# EAGLE design ambisoniqueAmpli (EAGLE 7.6.0)
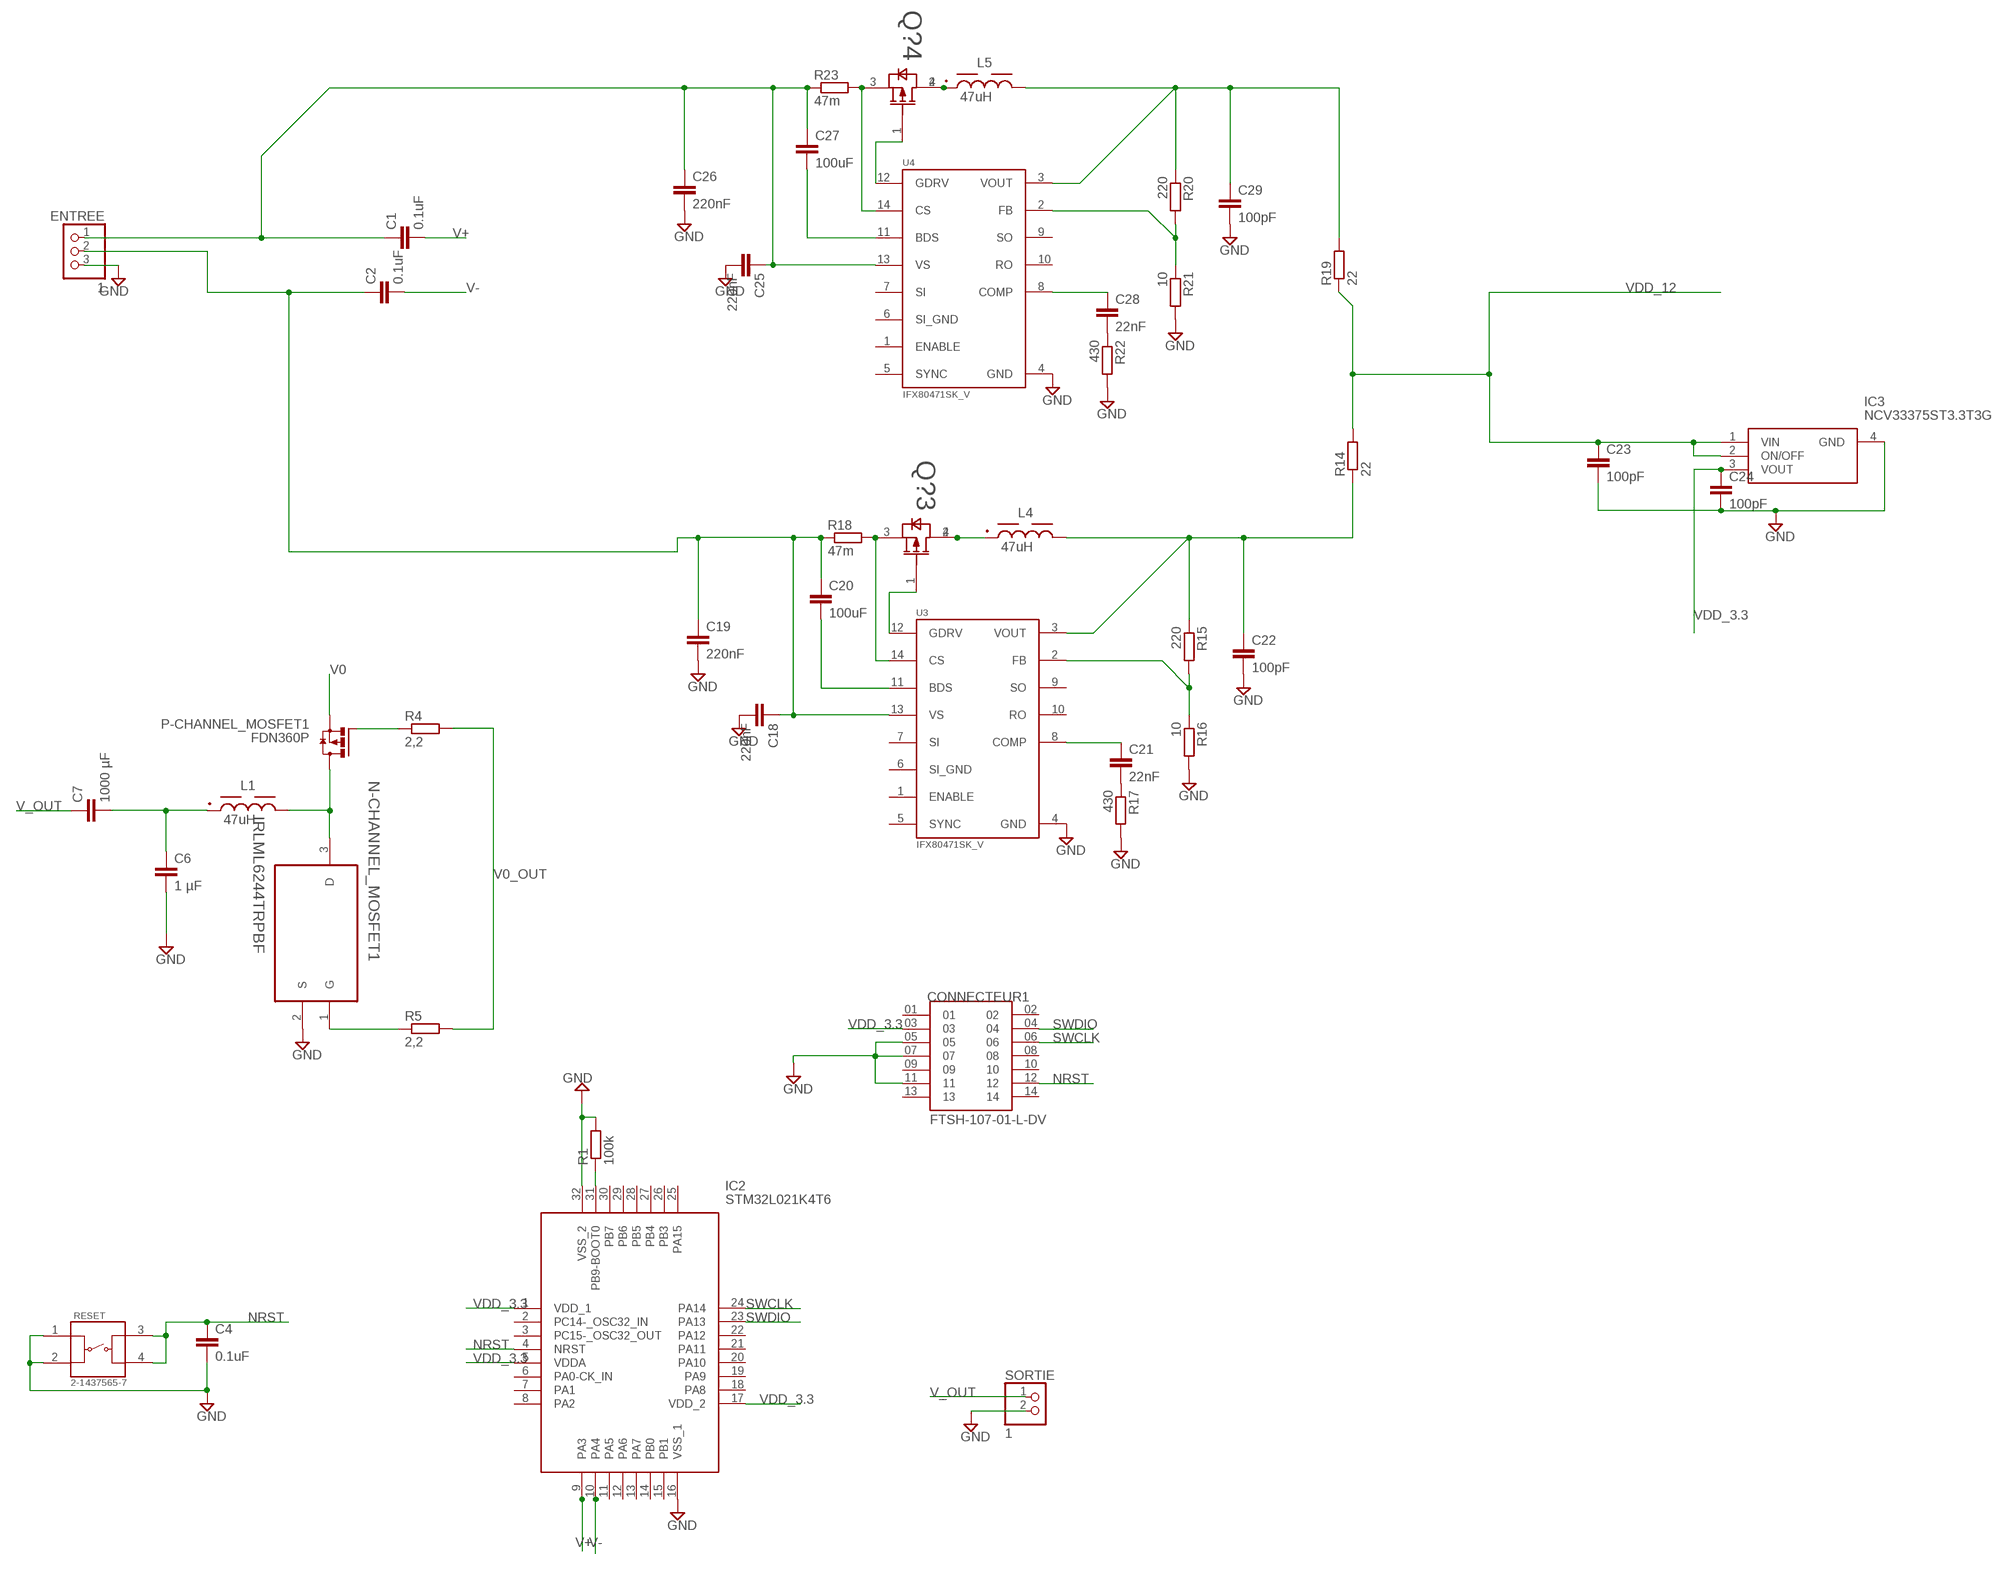
[diagram p0: schematic, sheet 1]

## Parts
C1  0.1uF  C-EUC0603  [C0603]
C2  0.1uF  C-EUC0603  [C0603]
C4  0.1uF  C-EUC0603  [C0603]
C6  1 µF  C-EUC0603  [C0603]
C7  1000 µF  C-EUC0603  [C0603]
C18  220nF  C-EUC0603  [C0603]
C19  220nF  C-EUC0603  [C0603]
C20  100uF  C-EUC0603  [C0603]
C21  22nF  C-EUC0603  [C0603]
C22  100pF  C-EUC0603  [C0603]
C23  100pF  C-EUC0603  [C0603]
C24  100pF  C-EUC0603  [C0603]
C25  220nF  C-EUC0603  [C0603]
C26  220nF  C-EUC0603  [C0603]
C27  100uF  C-EUC0603  [C0603]
C28  22nF  C-EUC0603  [C0603]
C29  100pF  C-EUC0603  [C0603]
CONNECTEUR1  FTSH-107-01-L-DV  [SAMTEC_FTSH-107-01-L-DV]
ENTREE  1  PINHD-1X3  [1X03]
IC2  STM32L021K4T6  [QFP80P900X900X160-32N]
IC3  NCV33375ST3.3T3G  [SOT230P700X175-4N]
L1  47uH  WE-PDA_1210_7847709470  [WE-PDA_1210]
L4  47uH  WE-PDA_1210_7847709470  [WE-PDA_1210]
L5  47uH  WE-PDA_1210_7847709470  [WE-PDA_1210]
N-CHANNEL_MOSFET1  IRLML6244TRPBF  [SOT95P237X112-3N]
P-CHANNEL_MOSFET1  FDN360P  [SUPER-SOT3]
Q?3  BSP613P  [SOT230P700X170-4N]
Q?4  BSP613P  [SOT230P700X170-4N]
R1  100k  R-EU_R0603  [R0603]
R4  2,2  R-EU_R0603  [R0603]
R5  2,2  R-EU_R0603  [R0603]
R14  22  R-EU_R0603  [R0603]
R15  220  R-EU_R0603  [R0603]
R16  10  R-EU_R0603  [R0603]
R17  430  R-EU_R0603  [R0603]
R18  47m  R-EU_R0603  [R0603]
R19  22  R-EU_R0603  [R0603]
R20  220  R-EU_R0603  [R0603]
R21  10  R-EU_R0603  [R0603]
R22  430  R-EU_R0603  [R0603]
R23  47m  R-EU_R0603  [R0603]
RESET  2-1437565-7  [SW_2-1437565-7]
SORTIE  1  PINHD-1X2  [1X02]
U3  IFX80471SK_V  [SOIC127P600X175-14N-8]
U4  IFX80471SK_V  [SOIC127P600X175-14N-8]

## Nets
GND: C4.2 C6.2 C18.2 C19.2 C22.2 C23.2 C24.2 C25.2 C26.2 C29.2 CONNECTEUR1.05 CONNECTEUR1.07 CONNECTEUR1.11 ENTREE.3 IC2.16(VSS_1) IC2.32(VSS_2) IC3.4(GND) N-CHANNEL_MOSFET1.2(S) R1.2 R16.2 R17.2 R21.2 R22.2 RESET.1 RESET.2 SORTIE.2 U3.4(GND) U4.4(GND)
N$1: C28.2 R22.1
N$2: IC2.31(PB9-BOOT0) R1.1
N$3: C21.2 R17.1
N$5: P-CHANNEL_MOSFET1.1(G) R4.1
N$6: L1.2 N-CHANNEL_MOSFET1.3(D) P-CHANNEL_MOSFET1.3(D)
N$7: C6.1 C7.2 L1.1
N$9: N-CHANNEL_MOSFET1.1(G) R5.1
N$27: Q?3.3(SOURCE) R18.2 U3.14(CS)
N$28: Q?3.1(GATE) U3.12(GDRV)
N$29: C20.2 U3.11(BDS)
N$31: L4.1 Q?3.2(DRAIN_1) Q?3.4(DRAIN_2)
N$32: C21.1 U3.8(COMP)
N$33: R15.2 R16.1 U3.2(FB)
N$34: C22.1 L4.2 R14.1 R15.1 U3.3(VOUT)
N$35: Q?4.3(SOURCE) R23.2 U4.14(CS)
N$36: Q?4.1(GATE) U4.12(GDRV)
N$37: C27.2 U4.11(BDS)
N$39: L5.1 Q?4.2(DRAIN_1) Q?4.4(DRAIN_2)
N$40: C28.1 U4.8(COMP)
N$41: R20.2 R21.1 U4.2(FB)
N$42: C29.1 L5.2 R19.2 R20.1 U4.3(VOUT)
NRST: C4.1 CONNECTEUR1.12 IC2.4(NRST) RESET.3 RESET.4
SWCLK: CONNECTEUR1.06 IC2.24(PA14)
SWDIO: CONNECTEUR1.04 IC2.23(PA13)
V0: P-CHANNEL_MOSFET1.2(S)
V0_OUT: R4.2 R5.2
V+: C1.2 IC2.9(PA3)
V+_IN: C1.1 C25.1 C26.1 C27.1 ENTREE.1 R23.1 U4.13(VS)
V-: C2.2 IC2.10(PA4)
V-_IN: C2.1 C18.1 C19.1 C20.1 ENTREE.2 R18.1 U3.13(VS)
V_OUT: C7.1 SORTIE.1
VDD_3.3: C24.1 CONNECTEUR1.03 IC2.1(VDD_1) IC2.5(VDDA) IC2.17(VDD_2) IC3.3(VOUT)
VDD_12: C23.1 IC3.1(VIN) IC3.2(ON/OFF) R14.2 R19.1
Unconnected: CONNECTEUR1.01 CONNECTEUR1.02 CONNECTEUR1.08 CONNECTEUR1.09 CONNECTEUR1.10 CONNECTEUR1.13 CONNECTEUR1.14 IC2.2(PC14-_OSC32_IN) IC2.3(PC15-_OSC32_OUT) IC2.6(PA0-CK_IN) IC2.7(PA1) IC2.8(PA2) IC2.11(PA5) IC2.12(PA6) IC2.13(PA7) IC2.14(PB0) IC2.15(PB1) IC2.18(PA8) IC2.19(PA9) IC2.20(PA10) IC2.21(PA11) IC2.22(PA12) IC2.25(PA15) IC2.26(PB3) IC2.27(PB4) IC2.28(PB5) IC2.29(PB6) IC2.30(PB7) U3.1(ENABLE) U3.5(SYNC) U3.7(SI) U3.9(SO) U3.10(RO) U4.1(ENABLE) U4.5(SYNC) U4.7(SI) U4.9(SO) U4.10(RO)

## Power pins joined to a net without a drawn wire
SI_GND: U3.6(SI_GND) U4.6(SI_GND)

## Library data of the parts
C1 C2 C4 C6 C7 C18-C29 = rcl:C-EU: CAPACITOR, European symbol
CONNECTEUR1 = FTSH-107-01-L-DV:FTSH-107-01-L-DV; MANUFACTURER: Samtec; PARTREV: R; STANDARD: Manufacturer Recommendations
ENTREE = pinhead:PINHD-1X3: PIN HEADER
IC2 = SamacSys_Parts:STM32L021K4T6: ARM Microcontrollers - MCU 16/32-BITS MICROS Source: Datasheet <https://www.st.com/resource/en/datasheet/stm32l021k4.pdf>; DESCRIPTION: ARM Microcontrollers - MCU 16/32-BITS MICROS; HEIGHT: 1.6mm; MANUFACTURER_NAME: STMicroelectronics; MANUFACTURER_PART_NUMBER: STM32L021K4T6; MOUSER_PART_NUMBER: 511-STM32L021K4T6; MOUSER_PRICE-STOCK: https://www.mouser.co.uk/ProductDetail/STMicroelectronics/STM32L021K4T6?qs=dTJS0cRn7ohCWAWNqbLYkA%3D%3D
IC3 = SamacSys_Parts:NCV33375ST3.3T3G: ON SEMICONDUCTOR - NCV33375ST3.3T3G - Fixed LDO Voltage Regulator, 4.3V to 13V, 260mV Dropout, 3.3Vout, 300mAout, SOT-223-4 Source: Datasheet <http://www.onsemi.com/pub/Collateral/MC33375-D.PDF>; DESCRIPTION: ON SEMICONDUCTOR - NCV33375ST3.3T3G - Fixed LDO Voltage Regulator, 4.3V to 13V, 260mV Dropout, 3.3Vout, 300mAout, SOT-223-4; HEIGHT: 1.75mm; MANUFACTURER_NAME: onsemi; MANUFACTURER_PART_NUMBER: NCV33375ST3.3T3G; MOUSER_PART_NUMBER: 863-NCV33375ST3.3T3G; MOUSER_PRICE-STOCK: https://www.mouser.co.uk/ProductDetail/ON-Semiconductor/NCV33375ST33T3G?qs=Pqj8oIac8rWOl%252BM3OwXrOg%3D%3D
L1 L4 L5 = Eagle_WE-PDA (rev20b):WE-PDA_1210: WE-PDA SMD Shielded Power Inductor Characteristics Magnetically shielded version which results in a low leakage field High storage capacity High Saturation currents up to 23 A Very low self-losses at high switching frequency's Wide inductance spectrum available at all sizes Operating Temperature -40 °C up to +125 °C Core Material: NiZn Wire connection: welding technology Applications Multimedia applications Switching regulators with low operating voltages Integrated DC/DC-converter Perfect suitable for switching regulators with extremely high efficiency (> 86 %) Plastic base: Because of the one piece construction these are more suitable for high vibration or shock applications <https://www.we-online.com/catalog/media/o55118v209%20Family_WE-PDA.jpg> Details see: https://www.we-online.com/katalog/en/WE-PDA Updated by Ella Wu 2020-03-18 2020(C) Wurth Elektronik; DATASHEET-URL: https://www.we-online.com/catalog/datasheet/7847709470.pdf; FRES: 6.3MHz; IR: 3.2A; ISAT: 3.5A; MOUNT: SMT; PART-NUMBER: 7847709470; RDC-MAX: 67mOhm; RDC-TYP: 56mOhm
N-CHANNEL_MOSFET1 = IR-IRLML6244TRPBF@E:IRLML6244TRPBF: HEXFET Power MOSFET; MPN: IRLML6244TRPBF; OC_FARNELL: 1864517; OC_NEWARK: 84R9705; PACKAGE: SOT-3; SUPPLIER: International Rectifier
P-CHANNEL_MOSFET1 = transistor-power:FDN360P: Single P-Channel, PowerTrench (R) MOSFET Source: http://www.fairchildsemi.com/ds/FD/FDN360P.pdf
Q?3 Q?4 = BSP613P:BSP613P: BSP613P SOT230P700X170-4N Insulated-Gate Field-Effect Transistor (IGFET), P-Channel, Enhancement, Body Diode, Pin 1 Gate, 2 Drain, 3 Source, 4 Drain, 4 Pins
R1 R4 R5 R14-R23 = rcl:R-EU_: RESISTOR, European symbol
RESET = 2-1437565-7:2-1437565-7: FSM2JSMA=SMT,TACTILE,PB SWITCH Check availability <https://pricing.snapeda.com/parts/FSM2JSMA/TE%20Connectivity/view-part?ref=eda>; AVAILABILITY: In Stock; COMMENT: 2-1437565-7; CONFIGURATION_POLE-THROW: Single Pole - Single Throw; CONTACT_CURRENT_RATING: 50 mA; DESCRIPTION: Tactile Switch SPST-NO Top Actuated Surface Mount; MF: TE Connectivity; MP: FSM2JSMA; PACKAGE: None; PRICE: None; PURCHASE-URL: https://pricing.snapeda.com/search/part/FSM2JSMA/?ref=eda
SORTIE = pinhead:PINHD-1X2: PIN HEADER
U3 U4 = IFX80471SK V:IFX80471SK_V: IFX80471SK V Step-Down DC/DC Controller, Adjustable Version SOIC127P600X175-14N-8

## Board
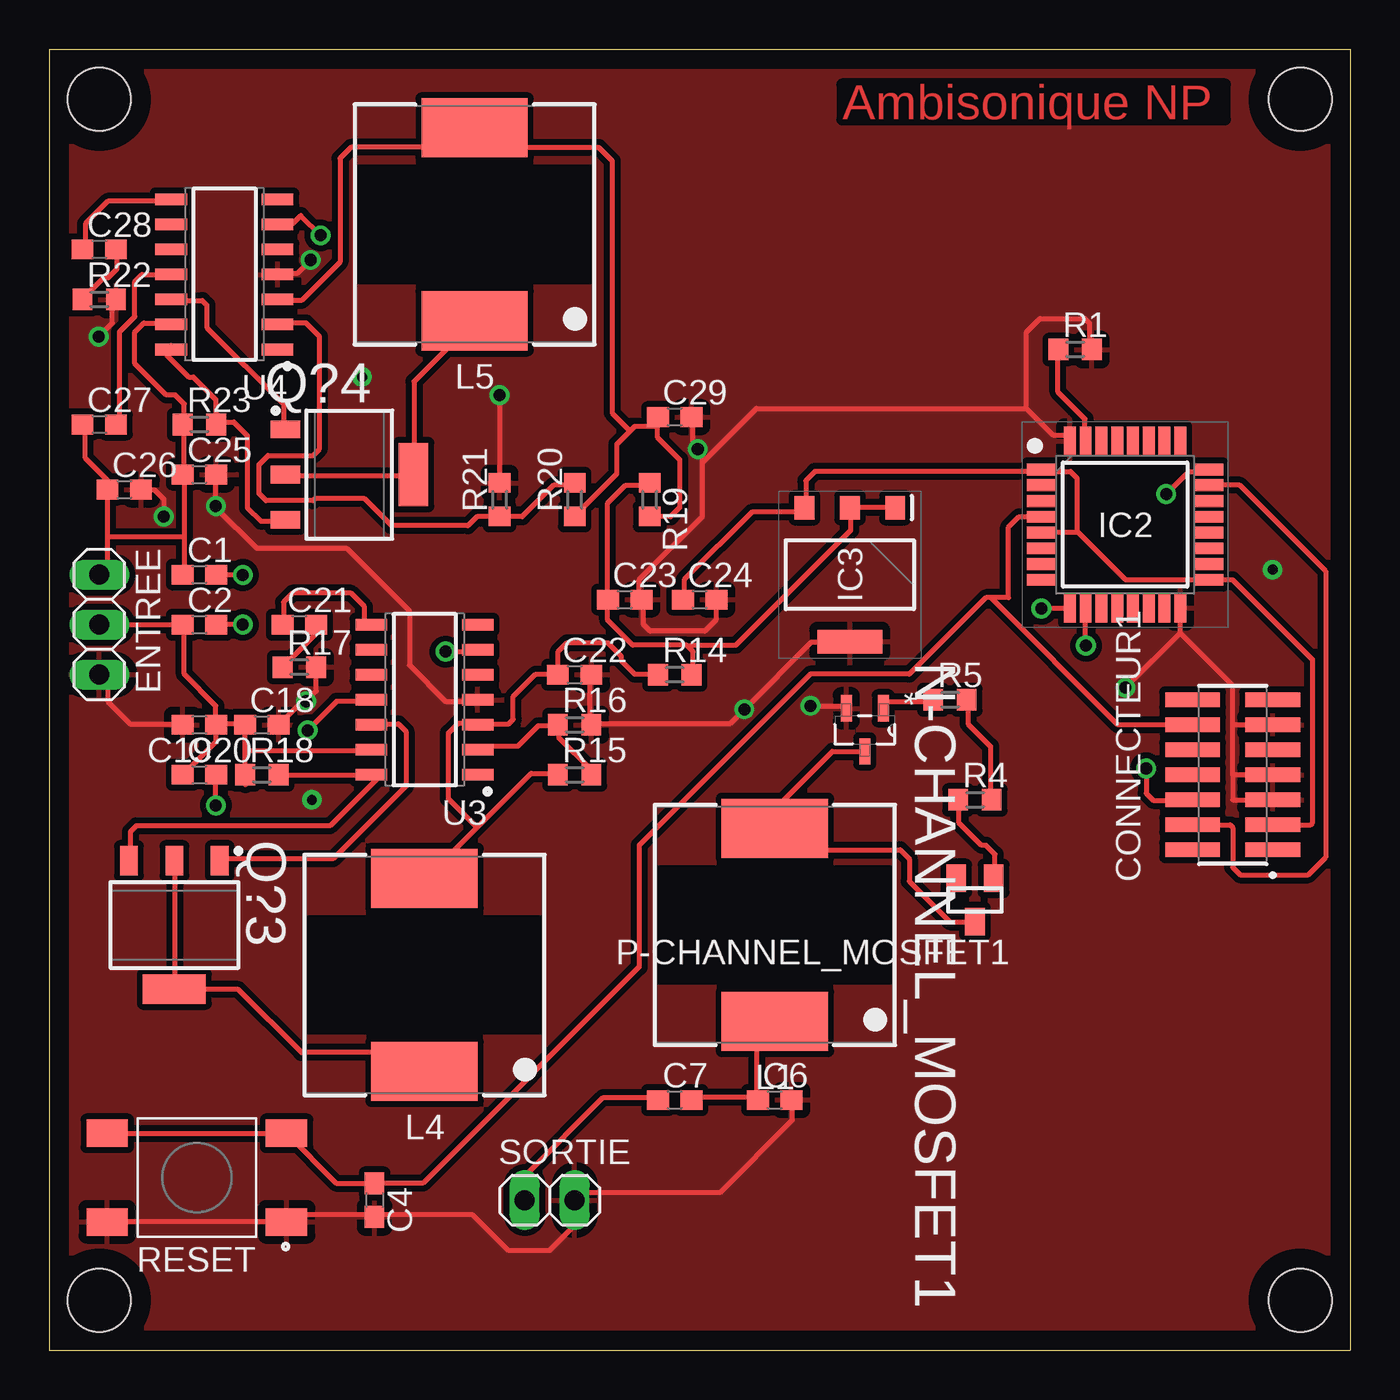
[diagram p1: board, top side]
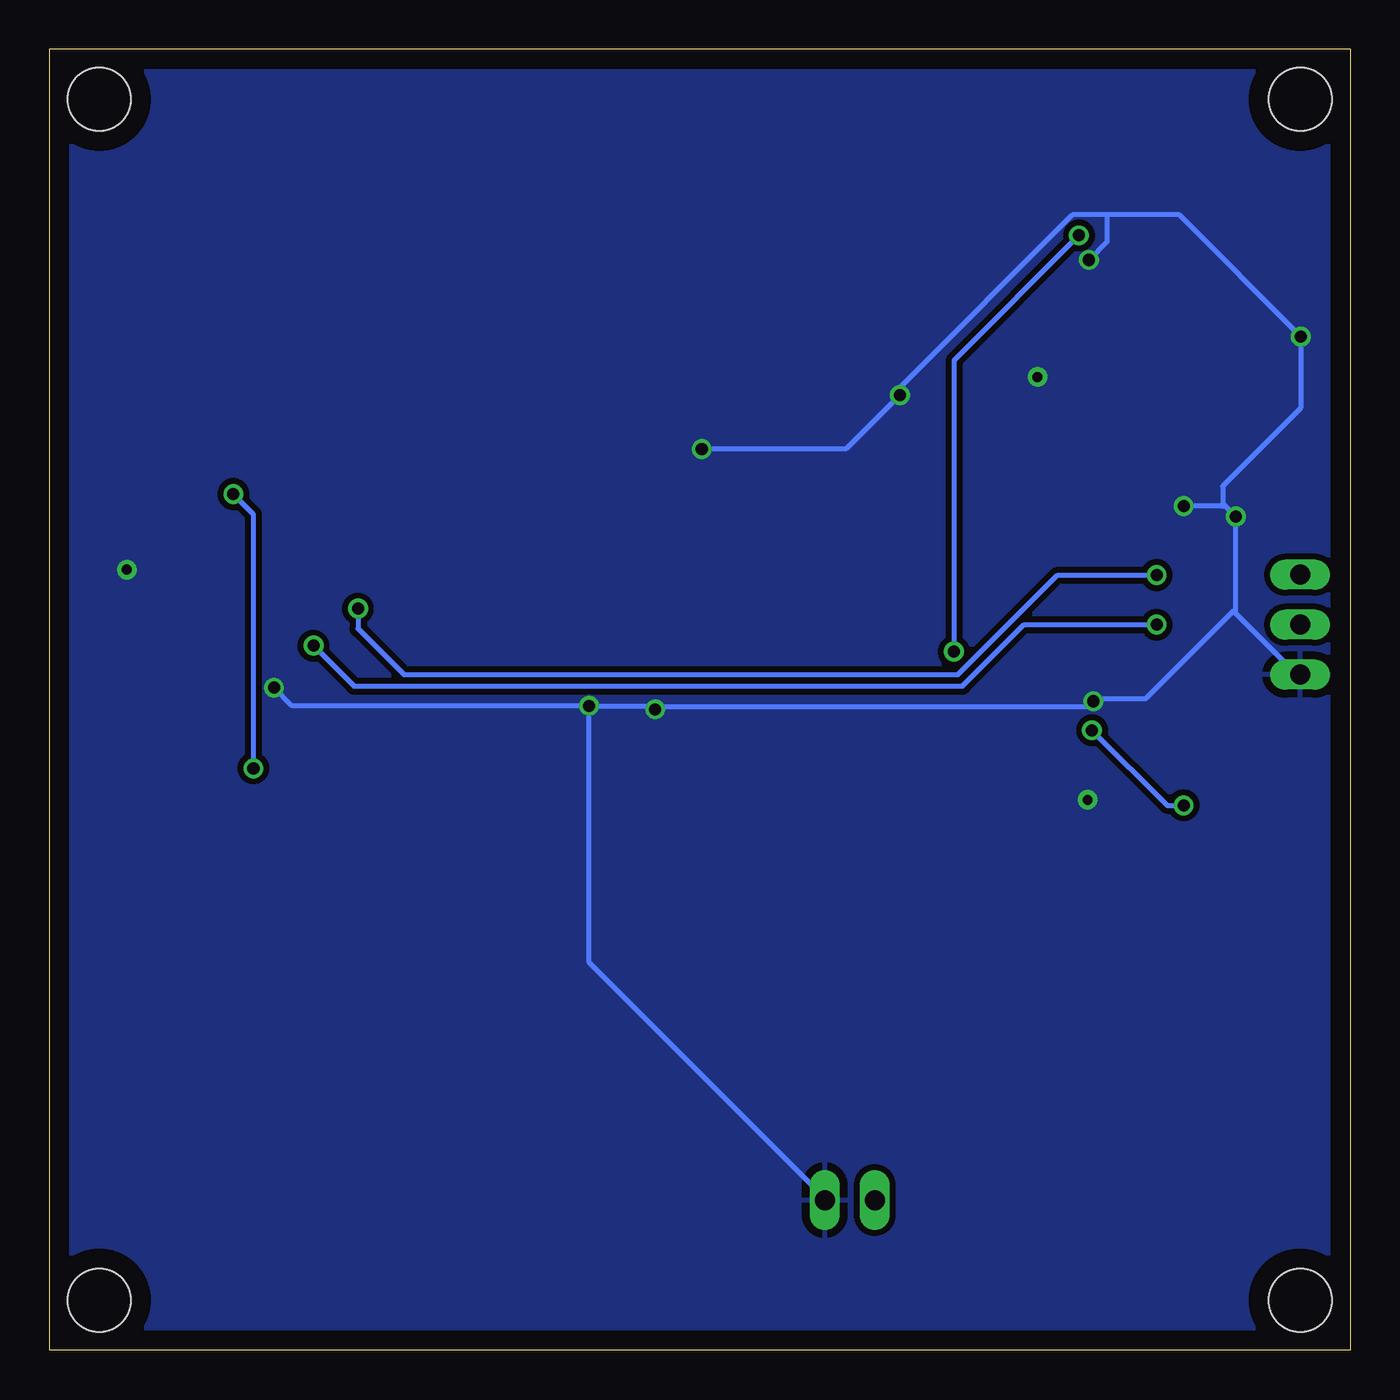
[diagram p2: board, bottom side, seen from below]

Size 66.04 x 66.04 mm. Coordinates in mm from the lower left corner, seen from the top.
Outline: 0,0 0,66.04 66.04,66.04 66.04,0 0.01,0
Copper layers (1*16): Top 0.035mm / dielectric 1.5mm / Bottom 0.035mm
Design rules "ENSEA_2022_04_08 *": minimum track width 0.2mm, minimum drill 0.6mm, track to track 0.3mm, track to pad 0.3mm, pad to pad 0.3mm, via to via 0.3mm, smd to smd 0.3mm, copper to edge 1mm, drill to drill 0.4mm, minimum pad ring 0.2mm, minimum via ring 0.2mm, stop-mask expansion 4mil, vias tented up to drill 0mil, thermal gap 0.4mm
Holes 3.2 mm at 2.54,2.54 2.54,63.5 63.5,63.5 63.5,2.54

### Footprints (pad centres in the part's own frame; a part is rotated, then mirrored left to right if it is on the bottom)
C0603 = smd 1.1 x 1: 1 -0.85,0; 2 0.85,0
SAMTEC_FTSH-107-01-L-DV = smd 0.74 x 2.79: 01 -3.81,-2.035; 02 -3.81,2.035; 03 -2.54,-2.035; 04 -2.54,2.035; 05 -1.27,-2.035; 06 -1.27,2.035; 07 0,-2.035; 08 0,2.035; 09 1.27,-2.035; 10 1.27,2.035; 11 2.54,-2.035; 12 2.54,2.035; 13 3.81,-2.035; 14 3.81,2.035
1X03 = drill 1.016 long: 1 -2.54,0; 2 0,0; 3 2.54,0
QFP80P900X900X160-32N = smd 1.475 x 0.6: 1 -4.238,2.8; 2 -4.238,2; 3 -4.238,1.2; 4 -4.238,0.4; 5 -4.238,-0.4; 6 -4.238,-1.2; 7 -4.238,-2; 8 -4.238,-2.8; 17 4.238,-2.8; 18 4.238,-2; 19 4.238,-1.2; 20 4.238,-0.4; 21 4.238,0.4; 22 4.238,1.2; 23 4.238,2; 24 4.238,2.8 | smd 0.6 x 1.475: 9 -2.8,-4.238; 10 -2,-4.238; 11 -1.2,-4.238; 12 -0.4,-4.238; 13 0.4,-4.238; 14 1.2,-4.238; 15 2,-4.238; 16 2.8,-4.238; 25 2.8,4.238; 26 2,4.238; 27 1.2,4.238; 28 0.4,4.238; 29 -0.4,4.238; 30 -1.2,4.238; 31 -2,4.238; 32 -2.8,4.238
SOT230P700X175-4N = smd 1.2 x 1: 1 -3.4,2.3; 2 -3.4,0; 3 -3.4,-2.3 | smd 1.2 x 3.3: 4 3.4,0
WE-PDA_1210 = smd 5.4 x 3: 1 0,4.9; 2 0,-4.9
SOT95P237X112-3N = smd 1.321 x 0.559: 1 -1.092,0.94; 2 -1.092,-0.94; 3 1.092,0
SUPER-SOT3 = smd 1 x 1.4: 1 -0.95,-1.1; 2 0.95,-1.1; 3 0,1.1
SOT230P700X170-4N = smd 1.5 x 0.9: 1 -3.25,2.3; 2 -3.25,0; 3 -3.25,-2.3 | smd 1.5 x 3.2: 4 3.25,0
R0603 = smd 1 x 1.1: 1 -0.85,0; 2 0.85,0
SW_2-1437565-7 = smd 2.1 x 1.4: 1 -4.55,2.25; 2 4.55,2.25; 3 -4.55,-2.25; 4 4.55,-2.25
1X02 = drill 1.016 long: 1 -1.27,0; 2 1.27,0
SOIC127P600X175-14N-8 = smd 1.6 x 0.6: 1 -2.7,3.81; 2 -2.7,2.54; 3 -2.7,1.27; 4 -2.7,0; 5 -2.7,-1.27; 6 -2.7,-2.54; 7 -2.7,-3.81; 8 2.7,-3.81; 9 2.7,-2.54; 10 2.7,-1.27; 11 2.7,0; 12 2.7,1.27; 13 2.7,2.54; 14 2.7,3.81

### Placement (x,y rotation side)
C1  7.62,39.37 0 top
C2  7.62,36.83 0 top
C4  16.51,7.62 270 top
C6  36.83,12.7 0 top
C7  31.75,12.7 0 top
C18  10.79,31.75 0 top
C19  7.62,31.75 180 top
C20  7.62,29.21 0 top
C21  12.7,36.83 0 top
C22  26.67,34.29 0 top
C23  29.21,38.1 0 top
C24  33.02,38.1 0 top
C25  7.62,44.45 0 top
C26  3.81,43.69 0 top
C27  2.54,46.99 0 top
C28  2.54,55.88 0 top
C29  31.75,47.37 0 top
CONNECTEUR1  60.07,29.21 90 top
ENTREE  2.54,36.83 270 top
IC2  54.61,41.91 0 top
IC3  40.64,39.37 270 top
L1  36.83,21.59 180 top
L4  19.05,19.05 180 top
L5  21.59,57.15 180 top
N-CHANNEL_MOSFET1  41.4,31.5 270 top
P-CHANNEL_MOSFET1  46.99,22.86 180 top
Q?3  6.35,21.59 270 top
Q?4  15.24,44.45 0 top
R1  52.07,50.8 0 top
R4  46.99,27.94 0 top
R5  45.72,33.02 0 top
R14  31.75,34.29 0 top
R15  26.67,29.21 0 top
R16  26.67,31.75 0 top
R17  12.7,34.67 0 top
R18  10.79,29.21 0 top
R19  30.48,43.18 270 top
R20  26.67,43.18 90 top
R21  22.86,43.18 90 top
R22  2.54,53.34 0 top
R23  7.62,46.99 0 top
RESET  7.49,8.76 180 top
SORTIE  25.4,7.62 0 top
U3  19.05,33.02 180 top
U4  8.89,54.61 180 top

### Tracks (layer width: path | path; a pad name or v marks a point on that pad's centre or on a via)
GND  (via drill 0.5 pad 1, 0.61)
  Top 0.254: 49.61,47.8 49.61,51.69 50.29,52.38 52.58,52.38 52.81,52.15 52.81,51 R1.2 | 49.61,47.8 50.98,46.43 51.66,46.43 51.89,46.2 IC2.32 | C24.2 33.83,37.97 33.83,37.06 33.27,36.5 30.5,36.5 30.18,36.83 30.18,37.97 C23.2 29.95,38.2 29.95,39.12 33.15,42.32 33.15,45.06 | 33.15,45.06 33.15,45.52 v32.92,45.74 32.69,45.97 32.69,47.27 C29.2 | 49.61,47.8 35.89,47.8 33.15,45.06 | 13.49,34.47 R17.2 13.55,33.46 v13.03,32.94 12.84,32.94 C18.2 | ENTREE.3 2.97,33.86 2.97,32.94 4.12,31.8 6.63,31.8 C19.2 | C25.2 8.46,44.37 v8.46,42.85 8.46,42.77 10.52,40.72 15.09,40.72 18.29,37.52 18.29,34.77 20.12,32.94 21.72,32.94 U3.4 | v2.52,51.46 3.2,52.15 3.2,53.29 R22.2 | v22.86,48.49 R21.2 | v13.26,55.35 12.57,54.66 11.66,54.66 U4.4 | C22.2 27.43,34.09 27.43,31.8 R16.2 27.66,31.8 34.54,31.8 v35.28,32.54 38.66,35.92 40.46,35.92 IC3.4 | 62.2,28.14 CONNECTEUR1.05 60.07,27.94 60.07,29.21 | 62.2,29.06 CONNECTEUR1.07 60.07,29.21 | 61.95,31.8 61.98,31.8 CONNECTEUR1.11 60.07,31.75 | 12.22,6.66 RESET.1 | 3.07,6.66 RESET.2 RESET.1 | 11.99,6.66 RESET.1 | C6.2 37.72,12.6 37.72,11.68 34.06,8.03 26.98,8.03 26.75,7.8 SORTIE.2 26.52,7.57 26.52,6.2 25.38,5.05 23.32,5.05 21.49,6.88 16.69,6.88 C4.2 16.46,6.88 12.41,6.88 RESET.1 | v38.63,32.72 40.31,32.72 N-CHANNEL_MOSFET1.2 | C26.2 5.33,43.69 5.82,43.2 v5.82,42.32 | 60.07,29.21 60.07,31.75 | v54.63,33.63 57.41,36.4 | 57.41,36.4 IC2.16 | 60.07,31.75 60.07,33.74 57.41,36.4
  Bottom 0.254: 5.82,37.39 v5.82,42.32 6.48,42.98 | 5.82,37.39 2.74,34.31 ENTREE.3 | 5.82,37.39 5.94,37.52 10.39,33.07 12.9,33.07 v13.03,32.94 13.28,32.69 35.13,32.69 v35.28,32.54 35.46,32.72 v38.63,32.72 | v8.46,42.85 6.48,42.85 6.48,42.98 | 12.34,57.63 8.69,57.63 v2.52,51.46 2.52,47.83 6.48,43.87 6.48,42.98 | 12.34,57.63 14.1,57.63 22.86,48.87 v22.86,48.49 25.6,45.74 v32.92,45.74 | v13.26,55.35 12.34,56.26 12.34,57.63 | v38.63,32.72 38.63,19.68 26.75,7.8 SORTIE.2 | v54.63,33.63 53.75,32.74 38.66,32.74 v38.63,32.72
  other vias: 62.1,39.62 15.88,49.4 13.34,27.94
  pour Top: 0,0 66.04,0 66.04,66.04 0,66.04
  pour Bottom: 0,0 0,66.04 66.04,66.04 66.04,0
N$1
  Top 0.254: R22.1 1.83,53.52 2.74,54.43 2.97,54.43 3.43,54.89 3.43,55.8 C28.2
N$2
  Top 0.254: R1.1 51.21,50.77 51.21,48.64 52.58,47.27 52.58,46.2 IC2.31
N$3
  Top 0.254: 13.72,36.83 C21.2 13.55,36.37 R17.1
N$5
  Top 0.254: R4.1 46.18,27.91 46.18,26.77 47.32,25.63 47.55,25.63 48.01,25.17 48.01,24.03 P-CHANNEL_MOSFET1.1
N$6
  Top 0.254: N-CHANNEL_MOSFET1.3 39.75,30.4 37.03,27.69 37.03,26.54 L1.2 37.03,26.31 37.95,25.4 43.2,25.4 43.66,24.94 43.66,23.8 45.72,21.74 46.86,21.74 P-CHANNEL_MOSFET1.3
N$7
  Top 0.254: 35.89,12.83 32.69,12.83 C7.2 | 35.89,12.83 35.89,15.57 36.8,16.48 L1.1 | 35.89,12.83 C6.1
N$9
  Top 0.254: R5.1 44.81,32.94 42.43,32.94 N-CHANNEL_MOSFET1.1
N$27
  Top 0.254: 16.92,29.29 16.46,29.29 U3.14 | 11.71,29.29 R18.2 U3.14 | 16.92,29.29 14.25,26.62 4.42,26.62 4.12,26.31 4.12,24.94 Q?3.3 | 16.92,29.29 U3.14
N$28
  Top 0.254: Q?3.1 8.69,24.94 14.4,24.94 18.11,28.65 18.11,31.42 17.73,31.8 16.46,31.8 U3.12
N$29  (via drill 0.61)
  Top 0.254: v8.46,27.66 8.46,29.06 C20.2 | v13.11,31.47 14.58,32.94 16.23,32.94 U3.11
  Bottom 0.254: v8.46,27.66 9.3,27.66 v13.11,31.47
N$31
  Top 0.254: Q?3.2 6.4,24.71 6.4,18.54 Q?3.4 6.4,18.31 9.6,18.31 12.8,15.11 18.06,15.11 18.97,14.2 L4.1
N$32
  Top 0.254: U3.8 16,36.83 16,37.74 15.32,38.43 12.34,38.43 11.89,37.97 11.89,36.83 C21.1
N$33
  Top 0.254: R15.2 27.52,29.45 25.86,31.11 25.86,31.7 | 25.86,31.7 24.82,31.7 23.77,30.66 21.95,30.66 U3.2 | 25.86,31.7 R16.1
N$34
  Top 0.254: R14.1 30.86,34.31 29.72,34.31 29.03,35 29.03,35.23 28.35,35.92 26.29,35.92 25.83,35.46 25.83,34.31 C22.1 25.6,34.31 24.69,34.31 23.55,33.17 23.55,32.03 23.32,31.8 21.95,31.8 U3.3 21.67,31.83 20.75,31.83 20.27,31.34 20.27,27.99 21.72,26.54 | 21.72,26.54 19.2,24.03 L4.2 | 21.72,26.54 24.46,29.29 25.6,29.29 R15.1
N$35
  Top 0.254: 8.46,47.57 8.46,48.26 7.32,49.4 7.09,49.4 5.94,50.55 5.94,50.77 6.17,51 U4.14 | 8.46,47.57 8.46,47.12 R23.2 | 8.46,47.57 8.91,47.12 9.37,47.12 10.06,46.43 10.06,42.77 10.74,42.09 11.89,42.09 Q?4.3
N$36
  Top 0.254: Q?4.1 11.89,46.89 11.89,48.03 8,51.92 8,53.06 7.77,53.29 6.4,53.29 U4.12
N$37
  Top 0.254: 5.71,54.43 6.17,54.43 U4.11 4.7,54.61 4.34,54.25 4.34,52.48 3.56,51.69 3.56,47.53 C27.2
N$39
  Top 0.254: Q?4.2 12.12,44.37 18.29,44.37 Q?4.4 18.52,44.6 18.52,49.17 21.49,52.15 L5.1
N$40
  Top 0.254: C28.1 1.83,56.03 1.83,57.17 2.97,58.32 6.17,58.32 U4.8
N$41
  Top 0.254: 22.86,42.32 24,42.32 25.6,43.92 26.52,43.92 R20.2 | 22.86,42.32 21.72,42.32 21.26,41.86 17.37,41.86 16,43.23 13.49,43.23 13.39,43.13 11,43.13 10.64,43.48 10.64,44.96 11.1,45.41 13.39,45.41 13.72,45.74 13.72,51.46 13.03,52.15 11.66,52.15 U4.2 | 22.86,42.32 R21.1
N$42
  Top 0.254: 29.49,46.66 29.72,46.89 30.71,46.89 | 29.49,46.66 28.8,45.97 28.8,44.48 26.68,42.35 R20.1 | 30.71,46.89 30.86,46.89 30.86,46.35 32,45.21 32,42.77 31.55,42.32 30.63,42.32 R19.2 | 30.71,46.89 C29.1 | U4.3 11.66,53.29 12.8,53.29 14.76,55.24 14.76,60.5 15.32,61.06 20.57,61.06 21.49,61.98 L5.2 21.72,61.98 22.63,61.06 27.89,61.06 28.57,60.38 28.57,47.57 29.49,46.66
NRST
  Top 0.254: 12.22,11 RESET.3 | 3.07,11 RESET.4 11.97,11.01 11.99,11 RESET.3 | IC2.4 50.29,42.32 49.23,42.32 48.69,41.78 48.69,38.2 47.8,38.2 | 57.86,31.8 CONNECTEUR1.12 54.25,31.75 47.8,38.2 | 47.8,38.2 47.55,38.2 43.66,34.31 38.63,34.31 29.95,25.63 29.95,19.46 18.97,8.48 16.69,8.48 C4.1 16.46,8.48 14.57,8.48 RESET.3
SI_GND  (via drill 0.61)
  Top 0.254: v20.12,35.46 21.72,35.46 U3.6 | v13.77,56.59 12.76,57.59 12.34,57.17 11.66,57.17 U4.6
  Bottom 0.254: v20.12,35.46 20.12,50.24 v13.77,56.59
SWCLK  (via drill 0.61)
  Top 0.254: v56.69,43.46 57.84,44.6 58.75,44.6 IC2.24 | CONNECTEUR1.06 57.86,27.91 57.3,27.91 56.03,27.91 55.68,28.27 v55.68,29.54
  Bottom 0.254: v55.68,29.54 55.68,42.44 v56.69,43.46
SWDIO
  Top 0.254: IC2.23 58.98,43.92 60.43,43.92 64.8,39.55 64.8,25.02 63.91,24.13 60.45,24.13 60.07,24.51 60.07,26.54 59.94,26.67 CONNECTEUR1.04 58.09,26.77
V0_OUT
  Top 0.254: R4.2 47.78,28.14 47.78,30.66 46.63,31.8 46.63,32.94 R5.2
V+  (via drill 0.61)
  Top 0.254: v9.83,39.34 8.69,39.34 C1.2 | v50.37,37.64 51.78,37.64 IC2.9
  Bottom 0.254: v9.83,39.34 14.86,39.34 19.91,34.29 48.03,34.29 50.37,36.63 v50.37,37.64
V+_IN
  Top 0.254: 2.97,41.27 2.97,39.8 ENTREE.1 | 2.97,41.27 2.97,43.51 C26.1 2.97,43.74 2.97,44.15 1.83,45.29 1.83,46.89 C27.1 | 6.86,41.27 6.86,44.37 C25.1 6.86,44.6 6.86,46.89 R23.1 6.86,47.12 6.86,48.03 6.4,48.49 5.94,48.49 4.34,50.09 4.34,51.69 4.8,52.15 6.17,52.15 U4.13 | 6.86,41.27 6.86,39.57 C1.1 | 6.86,41.27 2.97,41.27
V-  (via drill 0.61)
  Top 0.254: v9.83,36.83 C2.2 | v52.63,35.76 52.58,35.81 52.58,37.52 IC2.10
  Bottom 0.254: v9.83,36.83 16.56,36.83 19.68,33.71 50.57,33.71 v52.63,35.76
V-_IN
  Top 0.254: ENTREE.2 C2.1 6.86,36.83 6.86,34.31 8.46,32.72 8.46,31.8 C19.1 | C20.1 6.86,29.29 8.46,30.89 8.46,31.57 C19.1 | U3.13 16.23,30.43 10,30.43 9.95,30.48 | R18.1 10.15,29 | C19.1 8.69,31.8 9.88,31.8 C18.1 9.95,30.48 | R18.1 9.95,30.48 | 9.95,28.71 R18.1
V_OUT
  Top 0.254: C7.1 30.86,12.83 28.12,12.83 24.23,8.94 24.23,7.8 SORTIE.1
VDD_3.3
  Top 0.254: C24.1 32.23,38.2 32.23,39.12 35.66,42.55 38.18,42.55 IC3.3 38.41,42.77 38.41,44.15 38.86,44.6 50.29,44.6 IC2.1 50.52,44.6 51.84,44.6 52.17,44.27 52.17,41.58 52.25,41.5 | IC2.5 52.25,41.5 | 52.25,41.5 54.63,39.12 58.75,39.12 IC2.17 58.98,39.12 60.06,39.12 64.14,35.04 64.14,26.77 64.03,26.67 CONNECTEUR1.03 62.2,26.77
VDD_12
  Top 0.254: IC3.1 42.75,42.77 40.69,42.77 IC3.2 40.69,42.55 40.69,41.63 34.85,35.79 32.56,35.79 32.46,35.69 | 32.46,35.69 32.69,35.46 32.69,34.31 R14.2 | 32.46,35.69 32.36,35.79 29.62,35.79 28.35,37.06 28.35,37.97 C23.1 28.35,38.2 28.35,43 29.26,43.92 30.4,43.92 R19.1

### Text on the board
Top: Ambisonique NP